# Altium schematic sheet Adapter_JLink.SchDoc
size 431 x 279 mm; Organization: ORGANIZATION; Address1: 207; Address2: 13399 104 Ave; Address3: Surrey BC, V3T 0C9; Address4: Canada; Revision: -; SheetNumber: 1; SheetTotal: 1; ENG_APP_DATE: --/--/--; DSN_APP_DATE: --/--/--; CHK_APP_DATE: --/--/--
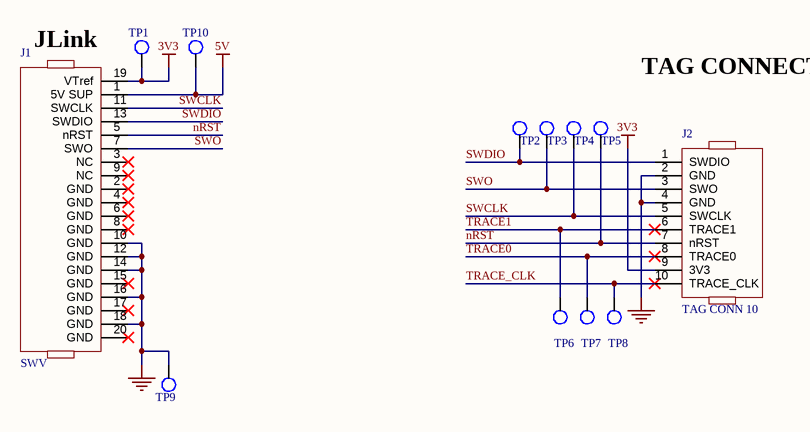
[diagram p0: Adapter_JLink.SchDoc]

## Parts
J1  SWV  [CONN HDR PLUG 20 2.54 TH STLINKV2]
J2  TAG CONN 10  [CONN HDR RECPT 10 2.54 TH TAG CONNECT]
TP1  1mm  [TESTPOINT_SMT]  (value not drawn)
TP2  1mm  [TESTPOINT_SMT]  (value not drawn)
TP3  1mm  [TESTPOINT_SMT]  (value not drawn)
TP4  1mm  [TESTPOINT_SMT]  (value not drawn)
TP5  1mm  [TESTPOINT_SMT]  (value not drawn)
TP6  1mm  [TESTPOINT_SMT]  (value not drawn)
TP7  1mm  [TESTPOINT_SMT]  (value not drawn)
TP8  1mm  [TESTPOINT_SMT]  (value not drawn)
TP9  1mm  [TESTPOINT_SMT]  (value not drawn)
TP10  1mm  [TESTPOINT_SMT]  (value not drawn)

## Nets
3V3: J1.19(VTref) J2.9(3V3) TP1.1
5V: J1.1(5V_SUP) TP10.1
GND: J1.10(GND) J1.12(GND) J1.14(GND) J1.16(GND) J1.18(GND) J2.2(GND) J2.4(GND) TP9.1
nRST: J1.5(nRST) J2.7(nRST) TP5.1
SWCLK: J1.11(SWCLK) J2.5(SWCLK) TP4.1
SWDIO: J1.13(SWDIO) J2.1(SWDIO) TP2.1
SWO: J1.7(SWO) J2.3(SWO) TP3.1
TRACE0: J2.8(TRACE0) TP7.1
TRACE1: J2.6(TRACE1) TP6.1
TRACE_CLK: J2.10(TRACE_CLK) TP8.1

Not connected (* = marked no-connect by the designer): J1 2(GND)* 3(NC)* 4(GND)* 6(GND)* 8(GND)* 9(NC)* 15(GND)* 17(GND)* 20(GND)*

## Notes on the sheet
- (near J1) JLink
- TAG CONNECT
- REV:
- PROJECT
- FaustOEM
- DESIGN ITEM:
- TITLE
- SHEET
- OF

## Library data of the parts
J1 = CONN HDR PLUG 20 2.54mm TH JLINK: Female, 20C, Straight .100"CC; No Mt. w/Center Polarizing Key; PBT, Brass, Gold Flash, 105 C; Manufacturer: Sullins; Manufacturer Part Number: SFH11-PBPC-D10-ST-BK; Number of Positions: 20; Connector Type: Header; Pitch: 0.1inch; Supplier 1: Digi-Key; RoHS: Yes; Category: Headers and Wire Housings; Stock 1: 18166; Pricing 1: 1=1.15000, 10=0.96800, 80=0.86925, 440=0.71118, 1000=0.63216, 5000=0.57070 (USD); Mount: Through Hole; Color: Black; Contact Plating: Gold; Package Quantity: 1; Number of Rows: 2; Packaging: Tray; Termination: Solder; Series: SFH11; Contact Type: Female Socket; Row Spacing: 0.1inch; Lead Free: Lead Free; RoHS Compliant: Yes; ComponentLink1URL: https://datasheet.ciiva.com/754/sfh11-pxxc-dxx-st-xx11160-c-754558.pdf?src-supplier=Digi-Key; ComponentLink1Description: https://datasheet.ciiva.com/754/sfh11-pxxc-dxx-st-xx11160-c-754558.pdf?src-supplier=Digi-Key; Supplier Part Number 1: S9197-ND
J2 = CONN HDR RECPT 10 2.54mm TH SWV: Conn Shrouded Header HDR 10 POS 2.54mm Solder ST Thru-Hole; Manufacturer: On-Shore Technology; Manufacturer Part Number: 302-S101; Number of Positions: 10; Connector Type: Male Pin; Pitch: 0.1inch; Supplier 1: Digi-Key; RoHS: Yes; Category: Connectors; Stock 1: 61558; Pricing 1: 1=0.29000, 10=0.24800, 100=0.19290, 500=0.16538, 1000=0.13781, 5000=0.11812, 10000=0.11025 (USD); Mount: Through Hole; Color: Black; Contact Plating: Gold; Number of Rows: 2; Packaging: Tray; Termination: Solder; Series: 302; Contact Type: Male Pin; Row Spacing: 0.1inch; ComponentLink1URL: https://datasheet.ciiva.com/732/302-sxxx-732946.pdf?src-supplier=Digi-Key; ComponentLink1Description: https://datasheet.ciiva.com/732/302-sxxx-732946.pdf?src-supplier=Digi-Key; Supplier Part Number 1: ED1543-ND
TP1-TP10 = TP 1mm: SMT testpoint